# EAGLE design simple-buffer-with-jacks-V0-3 (EAGLE 7.5.0)
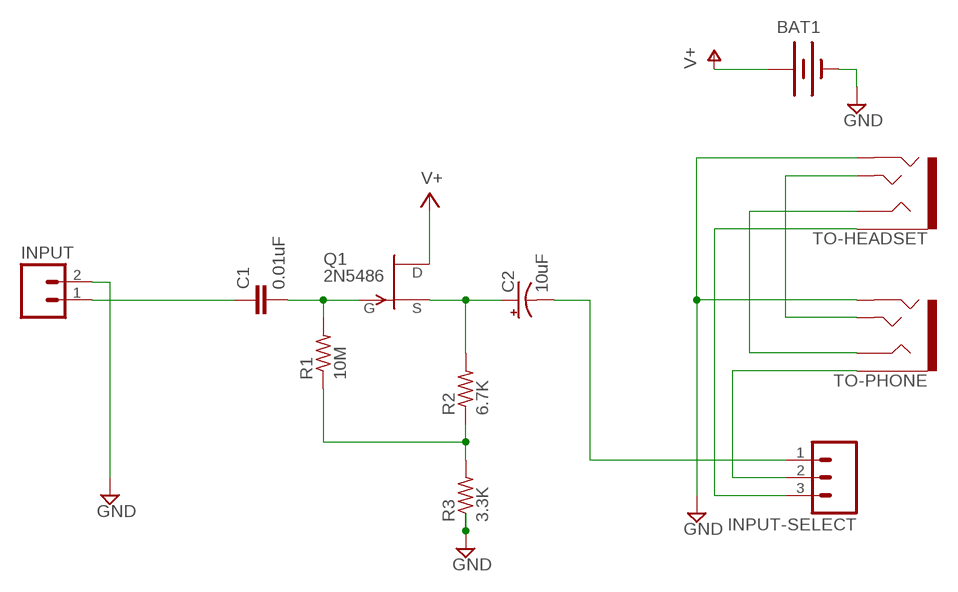
[diagram p0: schematic, sheet 1]

## Parts
BAT1  BATTERYAAA-KIT  [BATTERY-AAA-KIT]
C1  0.01uF  C5/3  [C5B3]
C2  10uF  CAP_POLPTH2  [CPOL-RADIAL-10UF-25V]
INPUT  M02LOCK  [1X02_LOCK]
INPUT-SELECT  M03LOCK  [1X03_LOCK]
Q1  2N5486  [TO92-]
R1  10M  R-US_V526-0  [V526-0]
R2  6.7K  R-US_V526-0  [V526-0]
R3  3.3K  R-US_V526-0  [V526-0]
TO-HEADSET  AUDIO-JACK3  [AUDIO-JACK-TRRS-SMD]
TO-PHONE  AUDIO-JACK3  [AUDIO-JACK-TRRS-SMD]

## Nets
GND: BAT1.GND@1(-) INPUT.2 R3.1 TO-HEADSET.RING2 TO-PHONE.RING2
JFET-GATE: C1.2 Q1.1(G) R1.2
JFET-SOURCE: C2.1(+) Q1.2(S) R2.2
N$1: C1.1 INPUT.1
N$2: C2.2(-) INPUT-SELECT.1
N$7: INPUT-SELECT.3 TO-HEADSET.EARTH
N$8: TO-HEADSET.TIP TO-PHONE.TIP
N$9: TO-HEADSET.RING1 TO-PHONE.RING1
N$10: R1.1 R2.1 R3.2
TO-PHONE: INPUT-SELECT.2 TO-PHONE.EARTH
V+: BAT1.PWR@1(+) Q1.3(D)

## Library data of the parts
BAT1 = Daniel:BATTERY: Battery Holders Various common sizes : AA, AAA, 18650 (PRT-12895), 20mm coin cell and 12mm coin cell. 20MM_4LEGS, BATT-10373; PROD_ID: BATT-08571
C1 = capacitor-wima:C: CAPACITOR naming: grid - package width
C2 = SparkFun-Passives:CAP_POL: Capacitor Polarized These are standard SMD and PTH capacitors. Normally 10uF, 47uF, and 100uF in electrolytic and tantalum varieties. Always verify the external diameter of the through hole cap, it varies with capacity, voltage, and manufacturer. The EIA devices should be standard.
INPUT = CMU-ArtFab:M02: Header 2 Standard 2-pin 0.1" header. Use with straight break away headers (SKU : PRT-00116), right angle break away headers (PRT-00553), swiss pins (PRT-00743), machine pins (PRT-00117), and female headers (PRT-00115). Molex polarized connector foot print use with SKU : PRT-08233 with associated crimp pins and housings.
INPUT-SELECT = SparkFun-Connectors:M03: Header 3 Standard 3-pin 0.1" header. Use with straight break away headers (SKU : PRT-00116), right angle break away headers (PRT-00553), swiss pins (PRT-00743), machine pins (PRT-00117), and female headers (PRT-00115). Molex polarized connector foot print use with SKU : PRT-08232 with associated crimp pins and housings.
Q1 = transistor-fet:?548*: N-Channel JFETs Source: VISHAY 2N5484.pdf Compatible: TO92 2N5245 J304 J305 U310 J308 J309 J310 TO72 2N4416 2N4416A 2N3823 2N4351 3N169 3N170 3N171 MFE3002 TO18 2N3796 2N3797 MFE825 Source: Motorola European Master Guide Pacge 3-59
R1-R3 = rcl:R-US_: RESISTOR, American symbol
TO-HEADSET TO-PHONE = SparkFun-Connectors:AUDIO-JACK3: Audio jack - 3.5mm TRRS variety - two rings.

## Board
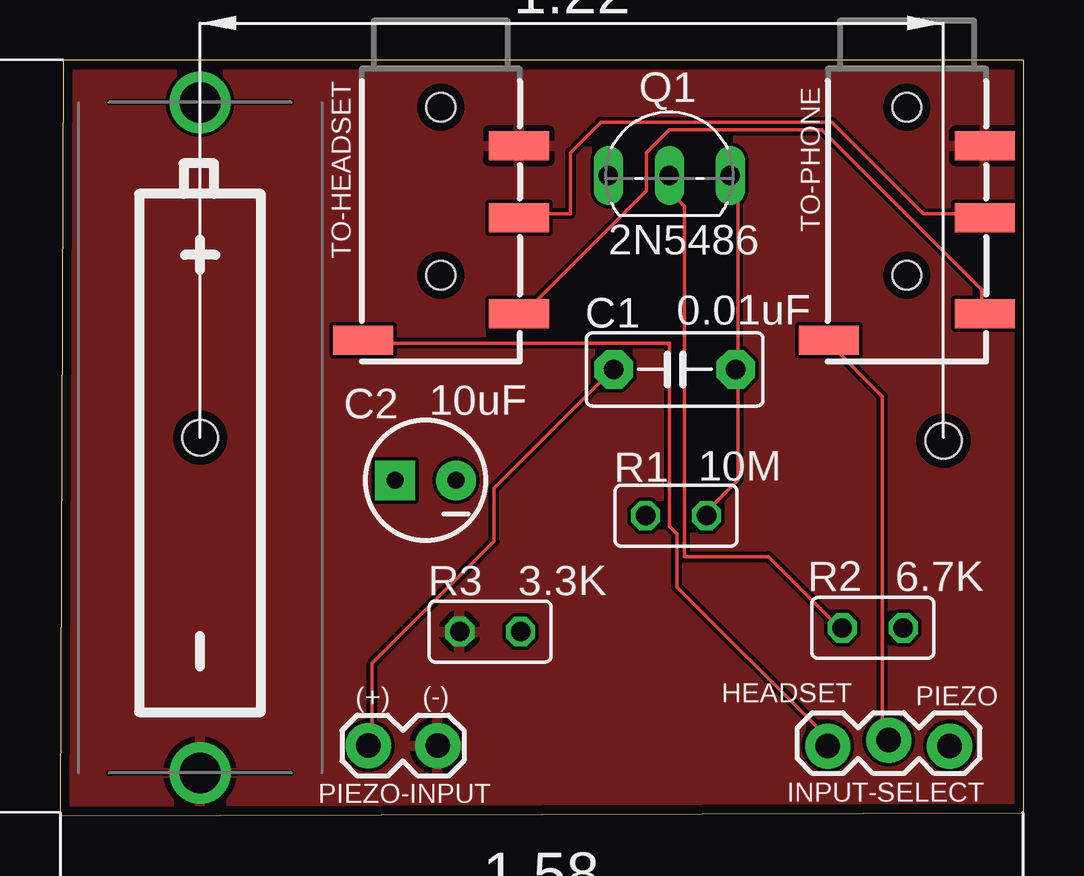
[diagram p1: board, top side]
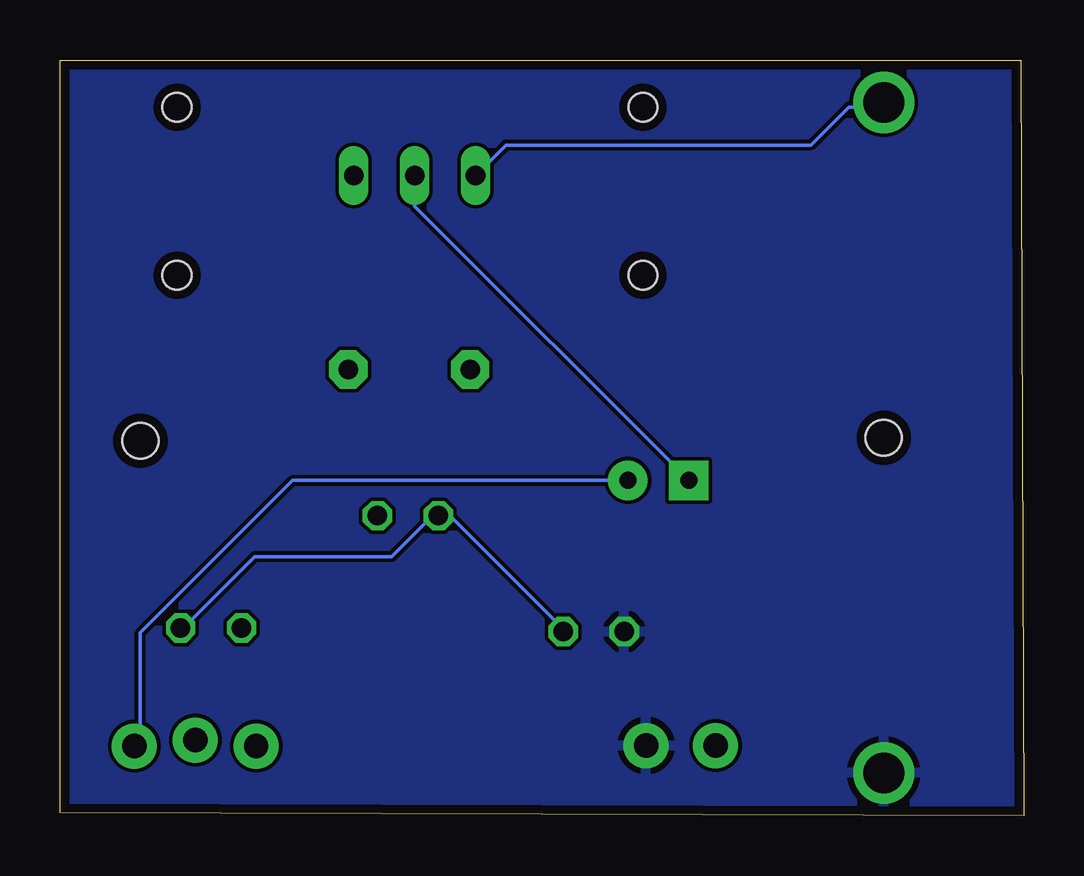
[diagram p2: board, bottom side, seen from below]

Size 40.18 x 31.49 mm. Coordinates in mm from the lower left corner, seen from the top.
Outline: 0,0 40.18,0.13 40.18,31.49 0.13,31.49 0,0
Copper layers (1*16): Top 0.0356mm / dielectric 1.5011mm / Bottom 0.0356mm
Design rules "oshpark-2layer": minimum track width 6mil, minimum drill 13mil, track to track 6mil, track to pad 6mil, pad to pad 6mil, via to via 6mil, smd to smd 6mil, copper to edge 15mil, drill to drill 6mil, minimum pad ring 7mil, minimum via ring 7mil, stop-mask expansion 2.5mil, vias tented up to drill 0mil, thermal gap 10mil
Holes 1.5 mm at 36.83,15.62 5.84,15.75

### Footprints (pad centres in the part's own frame; a part is rotated, then mirrored left to right if it is on the bottom)
BATTERY-AAA-KIT = drill 1.702: GND@1 13.97,0; PWR@1 -13.97,0
C5B3 = drill 0.813 pad 1.6 octagon: 1 -2.54,0; 2 2.54,0
CPOL-RADIAL-10UF-25V = drill 0.7 pad 1.651 square: 1 1.27,0 | drill 0.7 pad 1.651: 2 -1.27,0
1X02_LOCK = drill 1.016 pad 1.88: 1 -0.178,0; 2 2.718,0
1X03_LOCK = drill 1.016 pad 1.88: 1 0,0.127; 2 2.54,-0.127; 3 5.08,0.127
TO92- = drill 0.813 long: 1 2.54,0; 2 0,0; 3 -2.54,0
V526-0 = drill 0.813 octagon: 1 -1.27,0; 2 1.27,0
AUDIO-JACK-TRRS-SMD = smd 1.2 x 2.5: EARTH 11.3,-3.25; RING1 6.2,3.25; RING2 3.2,3.25; TIP 10.2,3.25 | hole 1.2: 1.6,0; 8.6,0

### Placement (x,y rotation side)
BAT1  5.84,15.75 270 top
C1  25.63,18.59 0 top
C2  15.24,13.97 180 top
INPUT  13.03,2.92 0 top
INPUT-SELECT  37.08,3.02 180 top
Q1  25.4,26.67 0 top
R1  25.68,12.5 0 top
R2  33.88,7.82 180 top
R3  17.93,7.67 0 top
TO-HEADSET  15.88,31.11 270 top
TO-PHONE  35.31,31.11 270 top

### Tracks (layer width: path | path; a pad name or v marks a point on that pad's centre or on a via)
GND
  pour Top: 0,0.13 40.13,0.13 40.13,31.11 0,31.11
  pour Bottom: 0,0.13 40.13,0.13 40.13,31.11 0,31.11
JFET-GATE
  Top 0.152: R1.2 26.99,12.7 28.26,13.97 28.26,18.41 C1.2 28.26,18.73 28.26,26.35 Q1.1
JFET-SOURCE
  Top 0.152: Q1.2 25.4,26.04 26.04,25.4 26.04,10.79 29.53,10.79 32.38,7.94 R2.2
  Bottom 0.152: C2.1 25.4,25.4 Q1.2
N$1
  Top 0.152: C1.1 22.86,18.41 18.1,13.65 18.1,11.43 13.02,6.35 13.02,3.17 INPUT.1
N$2
  Bottom 0.152: C2.2 30.48,13.97 36.83,7.62 36.83,3.17 INPUT-SELECT.1
N$7
  Top 0.152: TO-HEADSET.EARTH 12.7,19.68 25.4,19.68 25.4,12.06 25.72,11.75 25.72,9.53 31.75,3.49 31.75,3.17 INPUT-SELECT.3
N$8
  Top 0.152: TO-HEADSET.TIP 19.37,20.95 24.45,26.04 24.45,27.62 25.4,28.57 31.75,28.57 38.42,21.91 38.42,20.95 TO-PHONE.TIP
N$9
  Top 0.152: TO-HEADSET.RING1 19.37,25.08 21.27,25.08 21.27,27.62 22.54,28.89 32.17,28.89 35.99,25.07 37.13,25.07 37.15,25.08 38.42,25.08 TO-PHONE.RING1
N$10
  Bottom 0.152: R3.2 19.37,7.94 23.81,12.38 24.13,12.38 R1.1 24.45,12.38 24.77,12.38 26.35,10.79 32.07,10.79 34.92,7.94 R2.1
TO-PHONE
  Top 0.152: TO-PHONE.EARTH 32.07,19.68 34.29,17.46 34.29,3.17 INPUT-SELECT.2
V+
  Bottom 0.152: Q1.3 21.59,27.94 8.89,27.94 7.3,29.53 6.03,29.53 BAT1.PWR@1